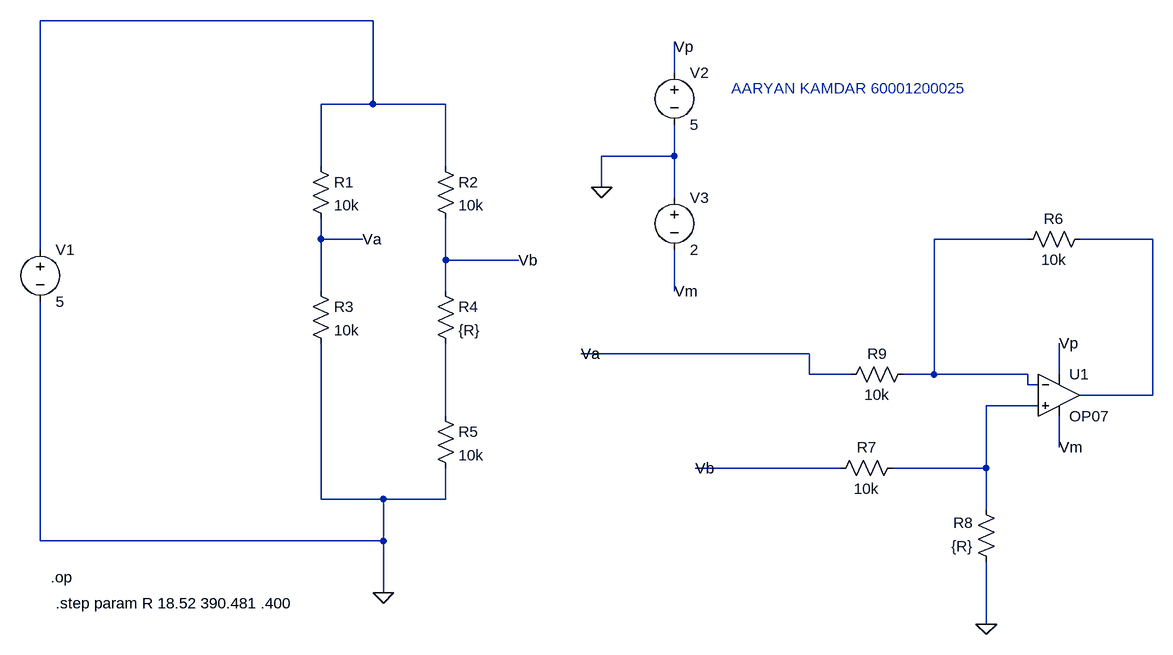
[diagram p0: schematic Draft2.asc]
Draft2.asc, the LTspice schematic file:
Version 4
SHEET 1 1412 820
WIRE 208 -128 -304 -128
WIRE 672 -48 672 -96
WIRE 208 0 208 -128
WIRE 208 0 128 0
WIRE 320 0 208 0
WIRE 672 80 672 32
WIRE 672 80 560 80
WIRE 128 96 128 0
WIRE 320 96 320 0
WIRE 560 128 560 80
WIRE 672 144 672 80
WIRE 128 208 128 176
WIRE 192 208 128 208
WIRE 1216 208 1072 208
WIRE 1408 208 1296 208
WIRE -304 224 -304 -128
WIRE 320 240 320 176
WIRE 432 240 320 240
WIRE 128 288 128 208
WIRE 320 288 320 240
WIRE 672 288 672 224
WIRE 880 384 528 384
WIRE 880 416 880 384
WIRE 944 416 880 416
WIRE 1072 416 1072 208
WIRE 1072 416 1024 416
WIRE 1216 416 1072 416
WIRE 1264 416 1264 368
WIRE 1216 432 1216 416
WIRE 1232 432 1216 432
WIRE 1408 448 1408 208
WIRE 1408 448 1296 448
WIRE 1232 464 1152 464
WIRE 320 480 320 368
WIRE 1264 528 1264 480
WIRE 928 560 704 560
WIRE 1152 560 1152 464
WIRE 1152 560 1008 560
WIRE 128 608 128 368
WIRE 224 608 128 608
WIRE 320 608 320 560
WIRE 320 608 224 608
WIRE 1152 624 1152 560
WIRE -304 672 -304 304
WIRE 224 672 224 608
WIRE 224 672 -304 672
WIRE 224 752 224 672
WIRE 1152 800 1152 704
FLAG 224 752 0
FLAG 1152 800 0
FLAG 560 128 0
SYMBOL res 112 80 R0
SYMATTR InstName R1
SYMATTR Value 10k
SYMBOL res 304 80 R0
SYMATTR InstName R2
SYMATTR Value 10k
SYMBOL res 112 272 R0
SYMATTR InstName R3
SYMATTR Value 10k
SYMBOL res 304 272 R0
SYMATTR InstName R4
SYMATTR Value {R}
SYMBOL res 304 464 R0
SYMATTR InstName R5
SYMATTR Value 10k
SYMBOL voltage -304 208 R0
WINDOW 123 0 0 Left 0
WINDOW 39 0 0 Left 0
SYMATTR InstName V1
SYMATTR Value 5
SYMBOL OpAmps\\OP07 1264 384 R0
SYMATTR InstName U1
SYMBOL res 1312 192 R90
WINDOW 0 0 56 VBottom 2
WINDOW 3 32 56 VTop 2
SYMATTR InstName R6
SYMATTR Value 10k
SYMBOL res 1024 544 R90
WINDOW 0 0 56 VBottom 2
WINDOW 3 32 56 VTop 2
SYMATTR InstName R7
SYMATTR Value 10k
SYMBOL res 1168 720 R180
WINDOW 0 36 76 Left 2
WINDOW 3 36 40 Left 2
SYMATTR InstName R8
SYMATTR Value {R}
SYMBOL res 1040 400 R90
WINDOW 0 0 56 VBottom 2
WINDOW 3 32 56 VTop 2
SYMATTR InstName R9
SYMATTR Value 10k
SYMBOL voltage 672 -64 R0
WINDOW 123 0 0 Left 0
WINDOW 39 0 0 Left 0
SYMATTR InstName V2
SYMATTR Value 5
SYMBOL voltage 672 128 R0
WINDOW 123 0 0 Left 0
WINDOW 39 0 0 Left 0
SYMATTR InstName V3
SYMATTR Value 2
TEXT -288 728 Left 2 !.op
TEXT -280 768 Left 2 !.step param R 18.52 390.481 .400
TEXT 760 -24 Left 2 ;AARYAN KAMDAR 60001200025
TEXT 192 208 Left 2 !Va
TEXT 432 240 Left 2 !Vb
TEXT 672 -88 Left 2 !Vp
TEXT 672 288 Left 2 !Vm
TEXT 1264 368 Left 2 !Vp
TEXT 1264 528 Left 2 !Vm
TEXT 528 384 Left 2 !Va
TEXT 704 560 Left 2 !Vb

The netlist it stands for:
* Draft2.asc
R1 N001 N003 10k
R2 N001 N006 10k
R3 N003 0 10k
R4 N006 N011 {R}
R5 N011 0 10k
V1 N001 0 5
XU1 N010 N004 N009 N012 N005 LT1001  ; OP07, pins In+ In- V+ V- OUT
R6 N005 N004 10k
R7 N010 N013 10k
R8 0 N010 {R}
R9 N004 N008 10k
V2 N002 0 5
V3 0 N007 2
.op
.step param R 18.52 390.481 .400
* AARYAN KAMDAR 60001200025
Va
Vb
Vp
Vm
Vp
Vm
Va
Vb
.lib LTC.lib
.backanno
.end